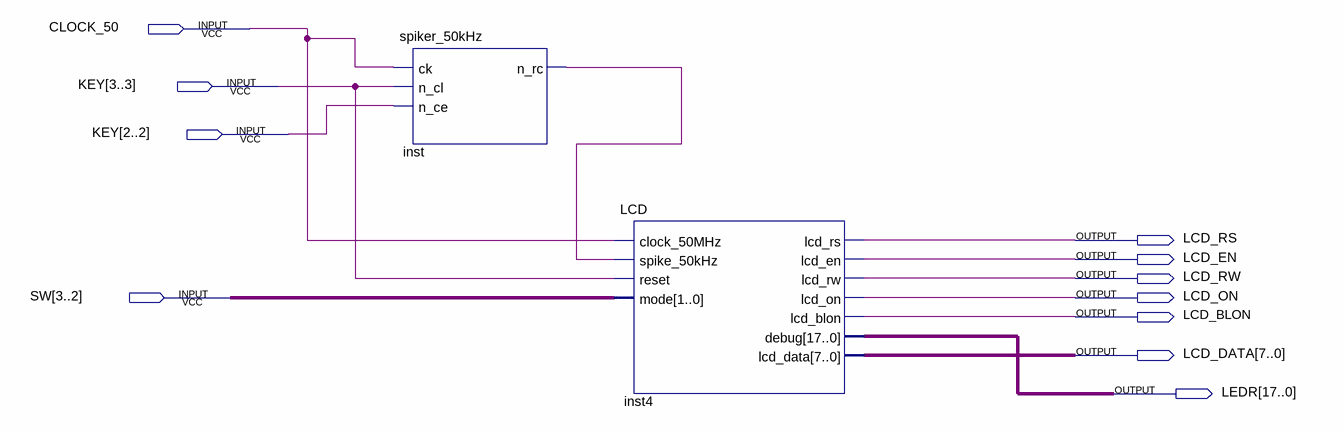
[diagram p0: schematic sheet]
// Quartus schematic lcd_modes_test.bdf as structural Verilog: 2 symbols, 11 pins
module lcd_modes_test (
  input  CLOCK_50,
  input  [3:2] KEY,
  input  [3:2] SW,
  output LCD_RS,
  output LCD_EN,
  output LCD_RW,
  output LCD_ON,
  output LCD_BLON,
  output [7:0] LCD_DATA,
  output [17:0] LEDR
);

  wire inst_n_rc;

  spiker_50kHz inst (.ck(CLOCK_50), .n_cl(KEY[3]), .n_ce(KEY[2]), .n_rc(inst_n_rc));
  LCD inst4 (
    .clock_50MHz(CLOCK_50), .spike_50kHz(inst_n_rc), .reset(KEY[3]), .mode(SW), .lcd_rs(LCD_RS),
    .lcd_en(LCD_EN), .lcd_rw(LCD_RW), .lcd_on(LCD_ON), .lcd_blon(LCD_BLON), .debug(LEDR), .lcd_data(LCD_DATA));
endmodule
